# Altium schematic sheet 02-RCB_Header.SchDoc
size B; SheetNumber: 2; SheetTotal: 14
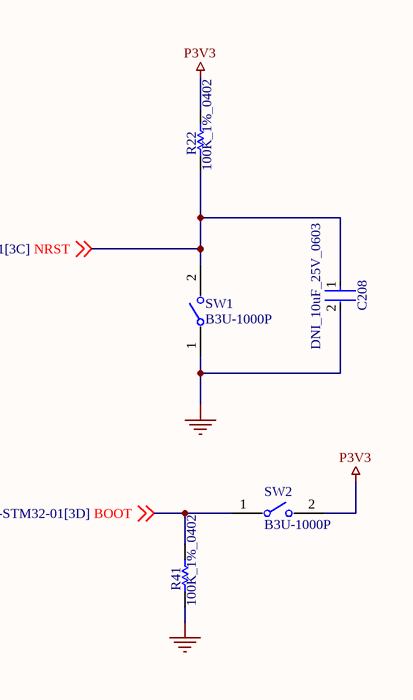
[diagram p0: 02-RCB_Header.SchDoc]

## Parts
C208  DNI_10uF_25V_0603  [FP-CL10-IPC_C]  (no BOM)
R22  100K_1%_0402  [RESC1005X40X25ML05T10]
R41  100K_1%_0402  [RESC1005X40X25ML05T10]
SW1  B3U-1000P  [FP-B3U-1000P-MFG]
SW2  B3U-1000P  [FP-B3U-1000P-MFG]

## Nets
GND: C208.2 R41.1 SW1.1
P3V3: R22.2 SW2.2
BOOT: R41.2 SW2.1 ; off-sheet BOOT
NRST: C208.1 R22.1 SW1.2 ; off-sheet NRST

## Library data of the parts
C208 = CMP-13271-004224-1: Cap Ceramic 10uF 25V X5R ±20% Pad SMD 0603 +85°C T/R; Width: 0.031inch; Voltage Rating: 25V; Length: 0.063inch; Case Code (Metric): 1608; Dielectric: X5R; Termination: Wraparound; Capacitance: 10uF; Lead Free: Lead Free; Mount: Surface Mount; Package Quantity: 1; Case Code (Imperial): 0603; Thickness: 0.035inch; Packaging: Tape and Reel; Contact Plating: Tin; Min Operating Temperature: -55°C; Tolerance: 20%; Max Operating Temperature: 85°C; Case/Package: 0603
R22 R41 = CMP-2002-07852-1: Manufacturer: Yageo; Part Number: RC0402FR-13100KL
SW1 SW2 = CMP-2100-03586-2: SWITCH TACTILE SPST-NO 0.05A 12V; Contact Resistance: 100mR; Operating Force: 1.5N; Max Current Rating: 50mA; Switch Travel: 0.15mm; Actuator Type: Standard; Mechanical Life: 200000Cycles; Ratings: Dust Proof; Illumination Type: Non-Illuminated; Throw Configuration: SPST; Actuator Length: 0.4mm; Switch Function: Off-Mom; Height: 1.2mm; Width: 3mm; Weight: 0.000776oz; Contact Material: Silver; Max Voltage Rating (DC): 12V; Insulation Resistance: 100MR; Lead Free: Lead Free; Current Rating: 50mA; Termination: SMD/SMT; Length: 4mm; Voltage Rating (DC): 12V; Contact Current Rating: 50mA; Orientation: Straight; Depth: 2.5mm; Max Operating Temperature: 70°C; Packaging: Tape and Reel; Min Operating Temperature: -25°C; Package Quantity: 1; Mount: Surface Mount; Electrical Life: 200000Cycles